# Altium schematic sheet Power.SchDoc
size A4; SheetNumber: 2; SheetTotal: 3; SPICEModelCacheVEIOBZSK: <root> / <DocumentId>VEIOBZSK</DocumentId> / </root>
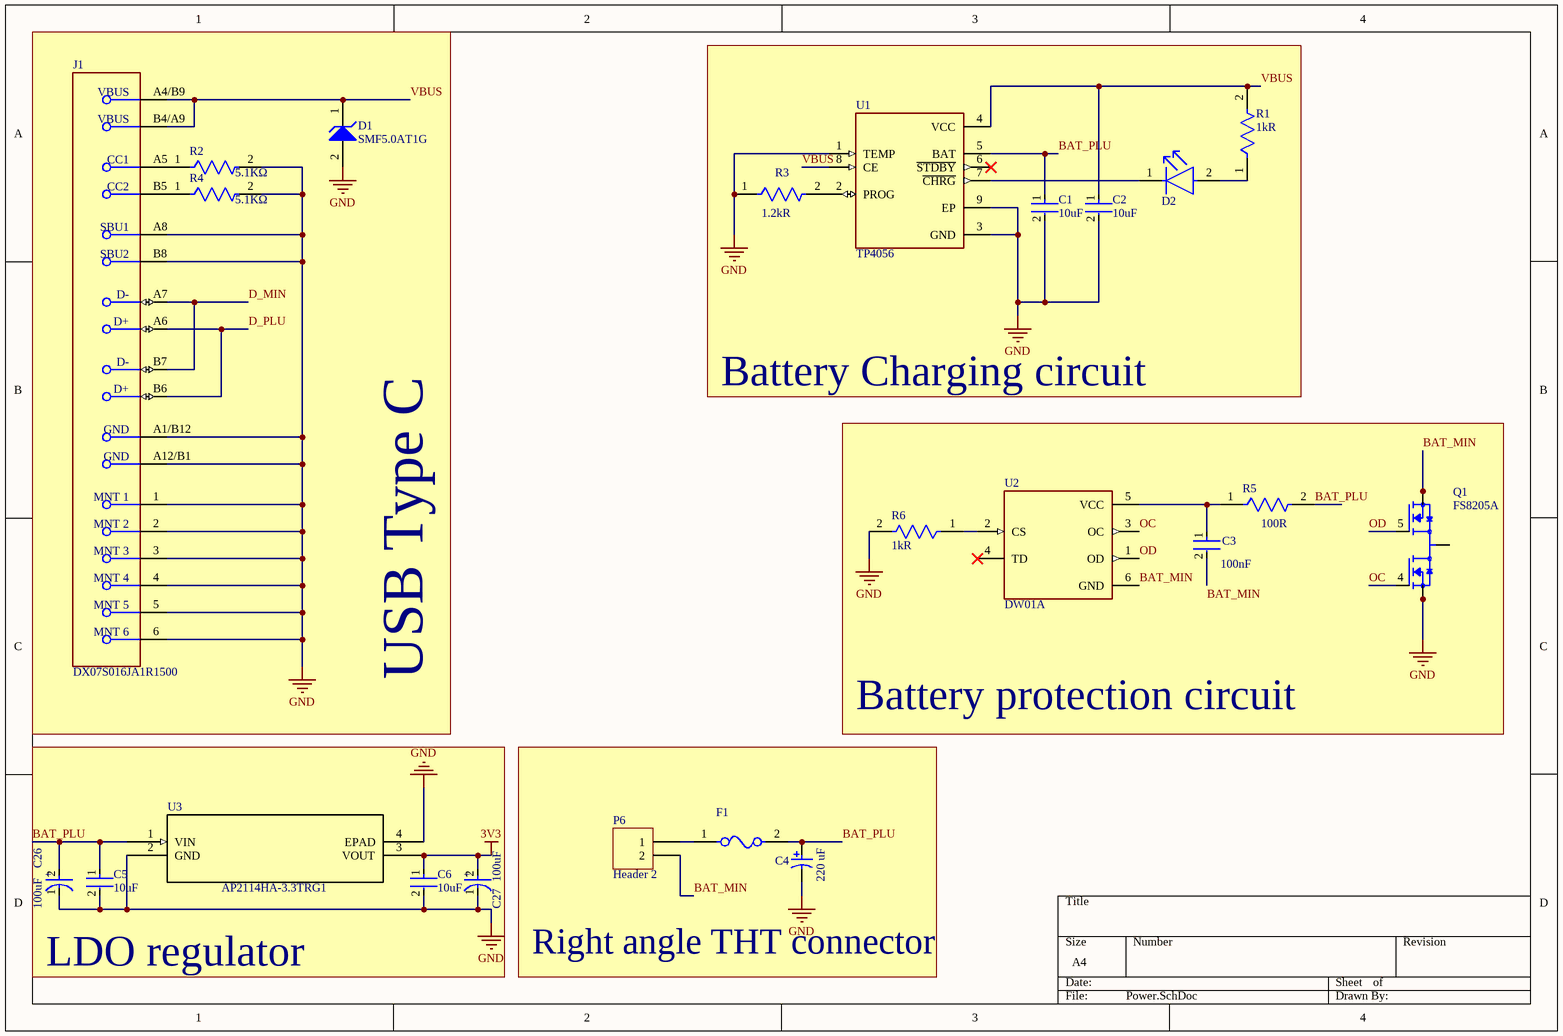
[diagram p0: Power.SchDoc]

## Parts
C1  Capacitance: 10uF  [FP-C0805C106J8RACAUTO-IPC_B]  (hidden comment: C0805C106J8RACAUTO)
C2  Capacitance: 10uF  [FP-C0805C106J8RACAUTO-MFG]  (hidden comment: C0805C106J8RACAUTO)
C3  Capacitance: 100nF  [FP-CC0805-EB-IPC_B]  (hidden comment: CC0805KKX7RYBB104)
C4  Rated Capacitance: 220 uF  [NIC-CAPA2-8X10_V]  (hidden comment: UUD1V221MNL1GS)
C5  Capacitance: 10uF  [FP-C0805C106J8RACAUTO-IPC_B]  (hidden comment: C0805C106J8RACAUTO)
C6  Capacitance: 10uF  [FP-C0805C106J8RACAUTO-IPC_B]  (hidden comment: C0805C106J8RACAUTO)
C26  Capacitance: 100uF  [FP-POSCAP-D2-MFG]  (hidden comment: 10TPC100M)
C27  Capacitance: 100uF  [FP-POSCAP-D2-MFG]  (hidden comment: 10TPC100M)
D1  SMF5.0AT1G  [ONSC-SOD-123FL-2-498_V]
D2  SML-LXT0805IW-TR  [FP-SML-LXT0805IW-TR-MFG]  (value not drawn)
F1  MF-NSMF200-2  [FP-MF-NSMF200-2-MFG]  (value not drawn)
J1  DX07S016JA1R1500  [FP-DX07S016JA1R1500-MFG]
P6  Header 2  [HDR1X2]
Q1  FS8205A  [SOP65P640X120-8N]
R1  Resistance: 1kR  [FP-MCU0805-IPC_B]  (hidden comment: MCU0805MD1001BP100)
R2  value 5.1KΩ  [FP-AC0805-IPC_B]  (hidden comment: AC0805JR-075K1L)
R3  Resistance: 1.2kR  [FP-RMCF0805-IPC_B]  (hidden comment: RMCF0805JG1K20)
R4  value 5.1KΩ  [FP-AC0805-IPC_B]  (hidden comment: AC0805JR-075K1L)
R5  Resistance: 100R  [FP-CRCW0805-HPe3-IPC_B]  (hidden comment: CRCW0805100RJNEAHP)
R6  Resistance: 1kR  [FP-MCU0805-IPC_B]  (hidden comment: MCU0805MD1001BP100)
U1  TP4056  [SOP127P600X175-9N]
U2  DW01A  [SOT95P280X145-6N]
U3  AP2114HA-3.3TRG1  [SOT-223_DIO]

## Blocks framed on the sheet
USB Type C: D1 J1 R2 R4
Battery Charging circuit: C1 C2 D2 R1 R3 U1
Battery protection circuit: C3 Q1 R5 R6 U2
LDO regulator: C5 C6 C26 C27 U3
Right angle THT connector: C4 F1 P6

## Nets
3V3: C6.1 C27.2(A) U3.3(VOUT)
GND: C1.2 C2.2 C4.2 C5.2 C6.2 C26.1(C) C27.1(C) D1.2(A) J1.1(MNT_1) J1.2(MNT_2) J1.3(MNT_3) J1.4(MNT_4) J1.5(MNT_5) J1.6(MNT_6) J1.A1/B12(GND) J1.A8(SBU1) J1.A12/B1(GND) J1.B8(SBU2) Q1.2(S1) Q1.3(S1) R2.2 R3.1 R4.2 R6.2 U1.1(TEMP) U1.3(GND) U1.9(EP) U3.2(GND) U3.4(EPAD)
BAT_MIN: C3.2 P6.2 Q1.6(S2) Q1.7(S2) U2.6(GND)
BAT_PLU: C1.1 C4.1 C5.1 C26.2(A) F1.2 R5.2 U1.5(BAT) U3.1(VIN)
D_MIN: J1.A7(D-) J1.B7(D-)
D_PLU: J1.A6(D+) J1.B6(D+)
OC: Q1.4(G1) U2.3(OC)
OD: Q1.5(G2) U2.1(OD)
VBUS: C2.1 D1.1(K) J1.A4/B9(VBUS) J1.B4/A9(VBUS) R1.2 U1.4(VCC) U1.8(CE)
NetC3_1: C3.1 R5.1 U2.5(VCC)
NetD2_1: D2.1(C) U1.7(~{CHRG})
NetD2_2: D2.2(A) R1.1
NetF1_1: F1.1 P6.1
NetJ1_A5: J1.A5(CC1) R2.1
NetJ1_B5: J1.B5(CC2) R4.1
NetQ1_1: Q1.1(D12) Q1.8(D12)
NetR3_2: R3.2 U1.2(PROG)
NetR6_1: R6.1 U2.2(CS)

Not connected (* = marked no-connect by the designer): U1 6(~{STDBY})*; U2 4(TD)*

## Notes on the sheet
- (in symbol CMP-05428-000328-1) +

## Library data of the parts
C1 C2 C5 C6 = CMP-03020-034708-1: CAP CER 10UF 10V X7R 0805; Tolerance: 5%; Mount: Surface Mount; Voltage Rating: 10V; Max Operating Temperature: 125°C; Min Operating Temperature: -55°C; Case/Package: 0805; RoHS Compliant: Yes; Packaging: Tape and Reel; Case Code (Imperial): 0805; Case Code (Metric): 2012; Ratings: AEC-Q200; LCSC Part: C15850
C3 = CMP-00621-107850848-1: CC0805KKX7RYBB104 Capacitor Ceramic 0.01uF 250V X7R 10% 0805 T/R; Material: Ceramic; Max Operating Temperature: 125°C; Tolerance: 10%; Case/Package: 0805; NexarPartId: 107850848; Height: 1.45mm; Min Operating Temperature: -55°C; Voltage Rating: 250V; LCSC Part: C28233
C4 = CMP-0687-00080-1: Aluminum Electrolytic Capacitor, UD Series, Low Impedance, 220 uF, 35 V, + / - 20%, -55 to 105 degC, Chip Type, 8 x 10 mm D x L, Pb-Free, Reel; Manufacturer: Nichicon; Tolerance Rated Capacitance: -20 to 20%; Rated Voltage: 35 V; Packing: Dia382mm Reel; Impedance: 0.17 Ohm; Endurance Time: 5000 h; Rated Ripple Current (at 100kHz): 450 mA; ComponentLink3URL: http://products.nichicon.co.jp/en/pdf/XJA043/e-ud.pdf; DatasheetVersion: 08/2012; PackageDescription: 2-Pin Surface Mount Device, Diameter 8 mm, Height 10 mm, Pitch 6.5 mm; Length: 10 mm; ComponentLink3Description: Package Specification; RoHS: TRUE; ComponentLink1URL: http://www.nichicon.co.jp/; PartNumber: UUD1V221MNL1GS; ComponentLink2Description: Datasheet; ComponentLink2URL: http://products.nichicon.co.jp/en/pdf/XJA043/e-ud.pdf; PackageReference: CAPAE-D8H10; Diameter: 8 mm; Mounting Technology: Surface Mount; ComponentLink1Description: Manufacturer URL; LCSC Part: C2836441
C26 C27 = CMP-05428-000328-1: Molded Tantalum Polymer Capacitor 100uF 20% 10V life 2000Hours SMD 2917; ESR (Equivalent Series Resistance): 45mR; Dissipation Factor: 10%; Leakage Current: 100uA; Ripple Current: 1.7A; Polarity: Polar; Height: 1.9mm; Case Code (Imperial): 2917; Depth: 4.3mm; Voltage Rating: 10V; Case/Package: 2917; Max Operating Temperature: 105°C; REACH SVHC: No SVHC; Voltage Rating (DC): 10V; Radiation Hardening: No; Voltage: 10V; Termination: SMD/SMT; Number of Pins: 2; Features: General Purpose; Min Operating Temperature: -55°C; Series: POSCAP™ TPC; Tolerance: 20%; Packaging: Tape and Reel; Package Quantity: 3000; Height - Seated (Max): 0.079inch; RoHS Compliant: Yes; Case Code (Metric): 7343; Length: 7.3mm; Lead Free: Lead Free; Mount: Surface Mount; Construction: Flat; Width: 4.3mm; LCSC Part: C7222
D1 = CMP-1061-00612-1: 200 W Transient Voltage Suppressor, 2-Pin SOD-123FL, Pb-Free, Tape and Reel; Manufacturer: On Semiconductor; Direction: Unidirectional; IR Max (uA): 400; V(BR) Typ (V): 6.7; PackageDescription: 2-Pin SOD, Body 1.65 x 2.7 mm; PartNumber: SMF5.0AT1G; ComponentLink3Description: Package Specification; ComponentLink3URL: http://www.onsemi.com/pub_link/Collateral/498-01.PDF; PackageVersion: Rev. D, 05/2013; Mounting Technology: Surface Mount; PackageReference: SOD-123FL-2-498; ComponentLink2URL: http://www.onsemi.com/pub_link/Collateral/SMF5.0AT1-D.PDF; DatasheetVersion: Rev. 7; ComponentLink1Description: Manufacturer URL; Packing: Tape and Reel; RoHS: Pb-Free; ComponentLink1URL: http://www.onsemi.com/; ComponentLink2Description: Datasheet; LCSC Part: C2857263
D2 = CMP-1724-00002-2: LED RED DIFFUSED SMD; Lens Style: Rectangular; Luminous Intensity: 11mcd; Approvals: UL; Test Current: 20mA; Forward Voltage: 2V; Number of LEDs: 1; Wavelength: 635nm; Lens Color: White; Viewing Angle: 140°; Min Operating Temperature: -25°C; Case Code (Metric): 2012; Mount: Surface Mount; Case Code (Imperial): 0805; Height: 0.8mm; Lead Free: Lead Free; Color: Red; Package Quantity: 1; Illumination Color: Red; Lens Transparency: Diffused; Forward Current: 20mA; Packaging: Tape and Reel; Length: 2mm; Case/Package: 0805; REACH SVHC: No SVHC; Width: 1.25mm; Number of Pins: 2; Max Operating Temperature: 80°C; Dominant Wavelength: 635nm; LCSC Part: C2297
F1 = CMP-07400-000004-1: PTC RESET FUSE 6V 2A 1206; Manufacturer: Bourns Inc.; Trip Time: 1s; Automotive Grade: Grade 3; Value: 85mΩ; Trip Current: 4A; Current Rating: 100A; RoHS: TRUE; Device Class L1: Circuit Protection; Manufacturer Part Number: MF-NSMF200-2; Height: 1.6mm; Device Class L3: unset; Ambient Temperature Range Low: -40°C; ComponentLink2URL: https://bourns.com/docs/product-datasheets/mfnsmf.pdf?sfvrsn=39c76af6_14; Lead Free: Yes; Temperature Range High: +85°C; Temperature Range Low: -40°C; Octopart: https://octopart.com/mf-nsmf200-2-bourns-90790; Ipc Land Pattern Name: CAPC325160X115; Device Class L2: PTC Resettable Fuses; ComponentLink2Description: Datasheet; Package: MF-NSMF200-2; Voltage Rating: 6V; Mouser Description: Resettable Fuses - PPTC 2V 6V 0.02ohm (R); Ambient Temperature Range High: +85°C; Hold Current: 2A; Digikey Description: PTC RESET FUSE 6V 2A 1206; Category: Fuse; Temperature: -40°C to +85°C; Automotive: Yes; Resistance: 85mΩ; LCSC Part: C269120
J1 = CMP-19038-000003-1: CONN RCP USB2.0 TYP C 24P SMD RA; LCSC Part: C3197885
P6 = Header 2: Header, 2-Pin; LatestRevisionDate: 17-Jul-2002; LatestRevisionNote: Re-released for DXP Platform.; Publisher: Altium Limited; LCSC Part: C32713268
Q1 = FS8205A: MF: Fortune Semiconductor; SnapEDA_Link: https://www.snapeda.com/parts/FS8205A/Fortune+Semiconductor/view-part/?ref=snap; Package: Package; Value: *; MP: FS8205A; Check_prices: https://www.snapeda.com/parts/FS8205A/Fortune+Semiconductor/view-part/?ref=eda; LCSC Part: C5148694
R1 R6 = CMP-02407-000288-1: RES 1.05K OHM 0.5% 1/5W 0805; Tolerance: 0.1%; Power Rating: 200mW; Voltage Rating: 150V; Max Operating Temperature: 155°C; Width: 1.25mm; Min Operating Temperature: -55°C; Case Code (Metric): 2012; Packaging: Tape and Reel; Case Code (Imperial): 0805; Length: 2mm; Height: 0.52mm; Case/Package: 0805; Weight: 0.000162oz; Composition: Thin Film; LCSC Part: C17513
R2 R4 = CMP-2001-04477-2: RES SMD 5.1K OHM 5% 1/8W 0805; Manufacturer: Yageo; Automotive Grade: Grade 0; Voltage Rating: 150V; Tolerance: 0.05; Category: Res; RoHS: TRUE; Automotive: Yes; Device Class L1: Passive Components; Lead Free: Yes; Octopart: https://octopart.com/ac0805jr-075k1l-yageo-21711115; Series: AC; Temperature Range High: +155°C; ComponentLink2URL: http://www.yageo.com/documents/recent/PYu-AC_51_RoHS_L_6.pdf; Temperature Range Low: -55°C; ComponentLink2Description: Datasheet; Footprint Url: http://www.yageo.com/exep/pages/download/literatures/PYu-R_Mount_10.pdf; Mouser Description: Thick Film Resistors - SMD 5.1K ohm 5% 1/8W; Device Class L3: Chip SMD Resistors; Digikey Description: RES SMD 5.1K OHM 5% 1/8W 0805; Power Rating: 1/8W; Package: AC0805; Temperature: -55°C to +155°C; Device Class L2: Resistors; Resistance: 5.1KΩ; Height: 0.6mm; Manufacturer Part Number: AC0805JR-075K1L; Ipc Land Pattern Name: RESC200125X50; Composition: Thick Film; LCSC Part: C27834
R3 = CMP-26527-005543-1: 1.2kΩ ±5% 0.125W 0805 Thick Film Chip Resistor AEC-Q200 compliant; Temperature Coefficient: 200ppm/°C; Max Power Dissipation: 125mW; RoHS Compliant: Yes; Width: 0.049inch; Max Operating Temperature: 155°C; Features: Automotive AEC-Q200; Contact Plating: Tin; Series: RMCF; Height: 0.026inch; Radiation Hardening: No; Packaging: Tape and Reel; Number of Terminations: 2; Length: 0.079inch; Min Operating Temperature: -55°C; Resistor Type: Thick Film; Case/Package: 0805; Tolerance: 5%; Mount: Surface Mount; LCSC Part: C17379
R5 = CMP-02407-002130-1: RES Thick Film, 100Ω, 5%, 0.5W, 200ppm/°C, 0805; Voltage Rating: 150V; Power Rating: 330mW; Max Power Dissipation: 333mW; Max Operating Temperature: 155°C; Temperature Coefficient: 200ppm/°C; Case Code (Imperial): 0805; Lead Free: Lead Free; Composition: Thick Film; Case/Package: 0805; Package Quantity: 1; Number of Terminations: 2; Contact Plating: Tin; Radiation Hardening: No; Case Code (Metric): 2012; Height: 0.024inch; Features: Automotive AEC-Q200; Length: 0.079inch; Tolerance: 5%; Width: 0.049inch; Packaging: Tape and Reel; Termination: SMD/SMT; Weight: 0.000194oz; Min Operating Temperature: -55°C; LCSC Part: C17408
U1 = TP4056: Complete single cell Li-Ion battery with a constant current / constant voltage linear charger; MF: NanJing Top Power ASIC Corp.; Check_prices: https://www.snapeda.com/parts/TP4056/NanJing+Top+Power+ASIC+Corp./view-part/?ref=eda; SnapEDA_Link: https://www.snapeda.com/parts/TP4056/NanJing+Top+Power+ASIC+Corp./view-part/?ref=snap; Price: None; Availability: Not in stock; Package: Package; MP: TP4056; Value: *; LCSC Part: C16581
U2 = DW01A: One Cell Lithium-ion/Polymer Battery Protection IC; MF: Fortune Semiconductor; SnapEDA_Link: https://www.snapeda.com/parts/DW01A/Fortune+Semiconductor/view-part/?ref=snap; Package: SOT-23-6 Fortune Semiconductor; Value: *; MP: DW01A; Check_prices: https://www.snapeda.com/parts/DW01A/Fortune+Semiconductor/view-part/?ref=eda; LCSC Part: C18164398
U3 = AP2114HA-3.3TRG1: Description; Manufacturer_Name: Diodes Inc; Copyright: Copyright (C) 2025 Ultra Librarian. All rights reserved.; Manufacturer_Part_Number: AP2114HA-3.3TRG1; RefDes: RefDes; Type: Type; LCSC Part: C460314